# EAGLE design TalonSRXBreakoutBoard (EAGLE 7.2.0)
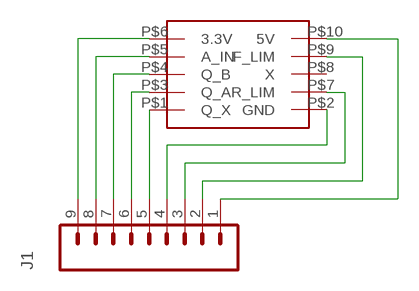
[diagram p0: schematic, sheet 1]

## Parts
J1  M09  [1X09]
U$1  TALONSRXBREAKOUT10PIN  [TALONSRXBREAKOUT]

## Nets
3.3V: J1.9 U$1.P$6(3.3V)
5V: J1.1 U$1.P$10(5V)
A_IN: J1.8 U$1.P$5(A_IN)
F_LIM: J1.2 U$1.P$9(F_LIM)
GND: J1.4 U$1.P$2(GND)
Q_A: J1.6 U$1.P$3(Q_A)
Q_B: J1.7 U$1.P$4(Q_B)
Q_X: J1.5 U$1.P$1(Q_X)
R_LIM: J1.3 U$1.P$7(R_LIM)
Unconnected: U$1.P$8(X)

## Library data of the parts
J1 = SparkFun-Connectors:M09: Header 9 Standard 9-pin 0.1" header. Use with straight break away headers (SKU : PRT-00116), right angle break away headers (PRT-00553), swiss pins (PRT-00743), machine pins (PRT-00117), and female headers (PRT-00115).
U$1 = TalonSRXBreakoutHeader:TALONSRXBREAKOUT

## Board
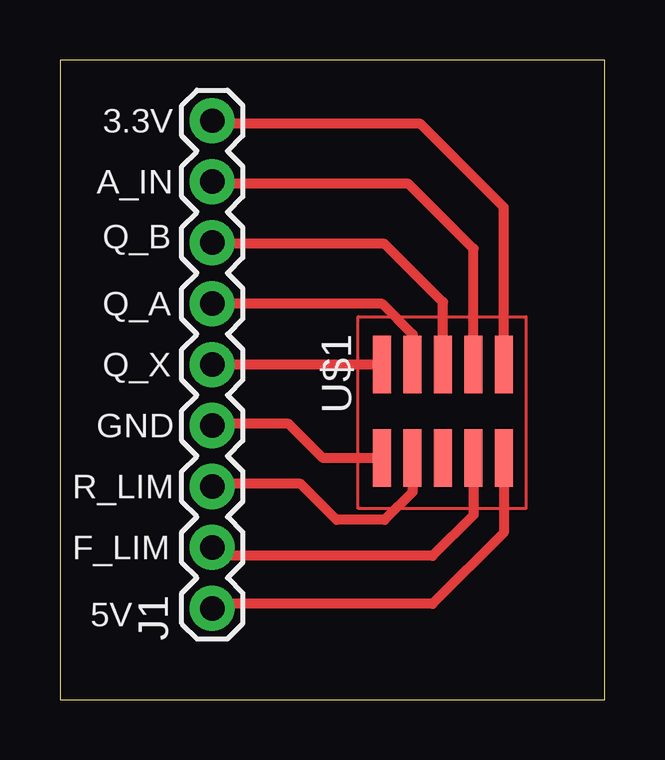
[diagram p1: board, top side]

Size 22.72 x 26.66 mm. Coordinates in mm from the lower left corner, seen from the top.
Outline: 0,0 22.72,0 22.72,26.66 0,26.66 0,0
Copper layers (1*16): Top 0.035mm / dielectric 1.5mm / Bottom 0.035mm
Design rules "default": minimum track width 10mil, minimum drill 24mil, track to track 8mil, track to pad 8mil, pad to pad 8mil, via to via 8mil, smd to smd 8mil, copper to edge 40mil, drill to drill 8mil, minimum pad ring 10mil, minimum via ring 8mil, stop-mask expansion 4mil, vias tented up to drill 0mil, thermal gap 10mil

### Footprints (pad centres in the part's own frame; a part is rotated, then mirrored left to right if it is on the bottom)
1X09 = drill 1.016 pad 1.88: 1 0,0; 2 2.54,0; 3 5.08,0; 4 7.62,0; 5 10.16,0; 6 12.7,0; 7 15.24,0; 8 17.78,0; 9 20.32,0
TALONSRXBREAKOUT = smd 2.4 x 0.76: P$1 0,0; P$2 3.9,0; P$3 0,1.27; P$4 0,2.54; P$5 0,3.81; P$6 0,5.08; P$7 3.9,1.27; P$8 3.9,2.54; P$9 3.9,3.81; P$10 3.9,5.08

### Placement (x,y rotation side)
J1  6.35,3.81 90 top
U$1  13.43,13.97 270 top

### Tracks (layer width: path | path; a pad name or v marks a point on that pad's centre or on a via)
3.3V
  Top 0.406: U$1.P$6 18.51,20.53 15.04,24 6.48,24 J1.9
5V
  Top 0.406: U$1.P$10 18.51,6.97 15.54,4 6.54,4 J1.1
A_IN
  Top 0.406: U$1.P$5 17.24,18.8 14.54,21.5 6.44,21.5 J1.8
F_LIM
  Top 0.406: U$1.P$9 17.24,7.7 15.54,6 6.7,6 J1.2
GND
  Top 0.406: U$1.P$2 10.97,10.07 9.54,11.5 6.42,11.5 J1.4
Q_A
  Top 0.406: U$1.P$3 14.7,15.24 13.44,16.5 J1.6
Q_B
  Top 0.406: U$1.P$4 15.97,16.57 13.54,19 6.4,19 J1.7
Q_X
  Top 0.406: U$1.P$1 J1.5
R_LIM
  Top 0.406: U$1.P$7 14.7,8.66 13.54,7.5 11.54,7.5 10.04,9 6.46,9 J1.3

### Text on the board
_tsilk: 3.3V | A_IN | Q_B | Q_A | Q_X | GND | R_LIM | F_LIM | 5V